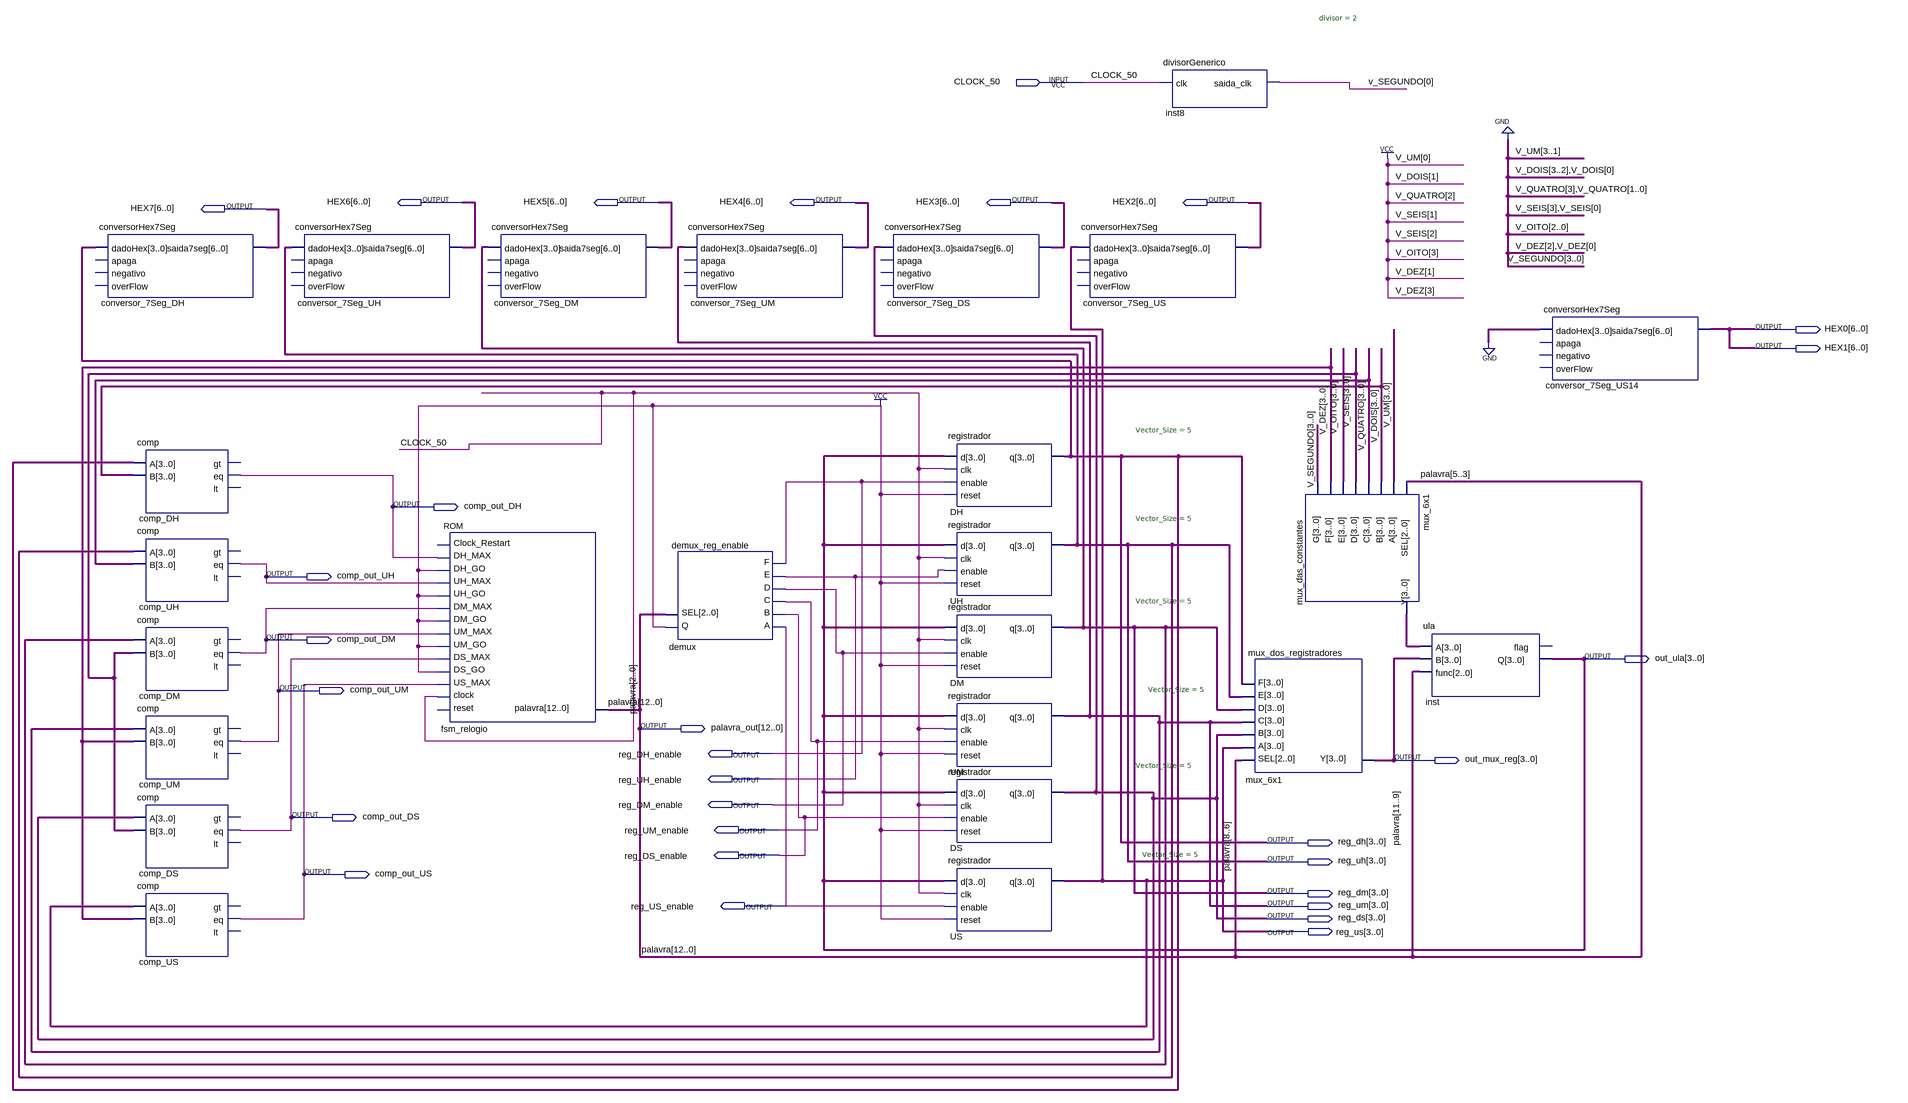
[diagram p0: schematic sheet]
// Quartus schematic diagrama_de_blocos_relogio.bdf as structural Verilog: 25 symbols, 30 pins
module diagrama_de_blocos_relogio (
  input  CLOCK_50,
  output [6:0] HEX6,
  output [6:0] HEX5,
  output [6:0] HEX4,
  output [6:0] HEX3,
  output [6:0] HEX2,
  output [6:0] HEX7,
  output [6:0] HEX0,
  output [6:0] HEX1,
  output comp_out_DH,
  output comp_out_UH,
  output comp_out_DM,
  output [3:0] out_ula,
  output comp_out_UM,
  output [12:0] palavra_out,
  output reg_DH_enable,
  output [3:0] out_mux_reg,
  output reg_UH_enable,
  output reg_DM_enable,
  output comp_out_DS,
  output reg_UM_enable,
  output [3:0] reg_dh,
  output reg_DS_enable,
  output [3:0] reg_uh,
  output comp_out_US,
  output [3:0] reg_dm,
  output reg_US_enable,
  output [3:0] reg_um,
  output [3:0] reg_ds,
  output [3:0] reg_us
);

  wire [0:0] v_SEGUNDO;
  wire [2:0] V_DEZ, V_OITO;
  wire [3:0] mux_das_constantes_y, V_DOIS, V_QUATRO, V_SEIS;
  wire [3:1] V_UM;

  conversorHex7Seg conversor_7Seg_DH (.dadoHex(reg_dh), .saida7seg(HEX7));  // open: apaga, negativo, overFlow
  comp comp_DH (.A(reg_dh), .B({V_DOIS[3:2], 1'b1, V_DOIS[0]}), .eq(comp_out_DH));  // open: gt, lt
  comp comp_UH (.A(reg_uh), .B({V_QUATRO[3], 1'b1, V_QUATRO[1:0]}), .eq(comp_out_UH));  // open: gt, lt
  comp comp_DM (.A(reg_dm), .B({V_SEIS[3], 2'b11, V_SEIS[0]}), .eq(comp_out_DM));  // open: gt, lt
  comp comp_UM (.A(reg_um), .B({1'b1, V_DEZ[2], 1'b1, V_DEZ[0]}), .eq(comp_out_UM));  // open: gt, lt
  comp comp_DS (.A(reg_ds), .B({V_SEIS[3], 2'b11, V_SEIS[0]}), .eq(comp_out_DS));  // open: gt, lt
  comp comp_US (.A(reg_us), .B({1'b1, V_DEZ[2], 1'b1, V_DEZ[0]}), .eq(comp_out_US));  // open: gt, lt
  conversorHex7Seg conversor_7Seg_UH (.dadoHex(reg_uh), .saida7seg(HEX6));  // open: apaga, negativo, overFlow
  fsm_relogio ROM (
    .clock(CLOCK_50), .US_MAX(comp_out_US), .DS_GO(1'b1), .DS_MAX(comp_out_DS), .UM_GO(1'b1),
    .UM_MAX(comp_out_UM), .DM_GO(1'b1), .DM_MAX(comp_out_DM), .UH_GO(1'b1), .UH_MAX(comp_out_UH),
    .DH_GO(1'b1), .DH_MAX(comp_out_DH), .palavra(palavra_out));  // open: reset, Clock_Restart
  conversorHex7Seg conversor_7Seg_DM (.dadoHex(reg_dm), .saida7seg(HEX5));  // open: apaga, negativo, overFlow
  conversorHex7Seg conversor_7Seg_UM (.dadoHex(reg_um), .saida7seg(HEX4));  // open: apaga, negativo, overFlow
  demux demux_reg_enable (
    .Q(1'b1), .SEL(palavra_out[2:0]), .A(reg_US_enable), .B(reg_DS_enable), .C(reg_UM_enable),
    .D(reg_DM_enable), .E(reg_UH_enable), .F(reg_DH_enable));
  conversorHex7Seg conversor_7Seg_DS (.dadoHex(reg_ds), .saida7seg(HEX3));  // open: apaga, negativo, overFlow
  registrador #(.Vector_Size(5)) DH (.d(out_ula), .clk(CLOCK_50), .enable(reg_DH_enable), .reset(1'b1), .q(reg_dh));
  registrador #(.Vector_Size(5)) UH (.d(out_ula), .clk(CLOCK_50), .enable(reg_UH_enable), .reset(1'b1), .q(reg_uh));
  registrador #(.Vector_Size(5)) DM (.d(out_ula), .clk(CLOCK_50), .enable(reg_DM_enable), .reset(1'b1), .q(reg_dm));
  registrador #(.Vector_Size(5)) UM (.d(out_ula), .clk(CLOCK_50), .enable(reg_UM_enable), .reset(1'b1), .q(reg_um));
  registrador #(.Vector_Size(5)) DS (.d(out_ula), .clk(CLOCK_50), .enable(reg_DS_enable), .reset(1'b1), .q(reg_ds));
  registrador #(.Vector_Size(5)) US (.d(out_ula), .clk(CLOCK_50), .enable(reg_US_enable), .reset(1'b1), .q(reg_us));
  conversorHex7Seg conversor_7Seg_US (.dadoHex(reg_us), .saida7seg(HEX2));  // open: apaga, negativo, overFlow
  divisorGenerico #(.divisor(2)) inst8 (.clk(CLOCK_50), .saida_clk(v_SEGUNDO[0]));
  mux_6x1 mux_dos_registradores (
    .SEL(palavra_out[8:6]), .A(reg_us), .B(reg_ds), .C(reg_um), .D(reg_dm), .E(reg_uh), .F(reg_dh),
    .Y(out_mux_reg));
  mux_6x1 mux_das_constantes (
    .SEL(palavra_out[5:3]), .A({V_UM, 1'b1}), .B({V_DOIS[3:2], 1'b1, V_DOIS[0]}),
    .C({V_QUATRO[3], 1'b1, V_QUATRO[1:0]}), .D({V_SEIS[3], 2'b11, V_SEIS[0]}), .E({1'b1, V_OITO}),
    .F({1'b1, V_DEZ[2], 1'b1, V_DEZ[0]}), .G({3'b000, v_SEGUNDO[0]}), .Y(mux_das_constantes_y));
  ula inst (.A(mux_das_constantes_y), .B(out_mux_reg), .func(palavra_out[11:9]), .Q(out_ula));  // open: flag
  conversorHex7Seg conversor_7Seg_US14 (.dadoHex(4'b0000), .saida7seg(HEX0));  // open: apaga, negativo, overFlow

  assign HEX1 = HEX0;
  // also tied to GND on the sheet: v_SEGUNDO[0]

  // Other names for the same wires on the sheet: palavra[12:0] = palavra_out
endmodule
